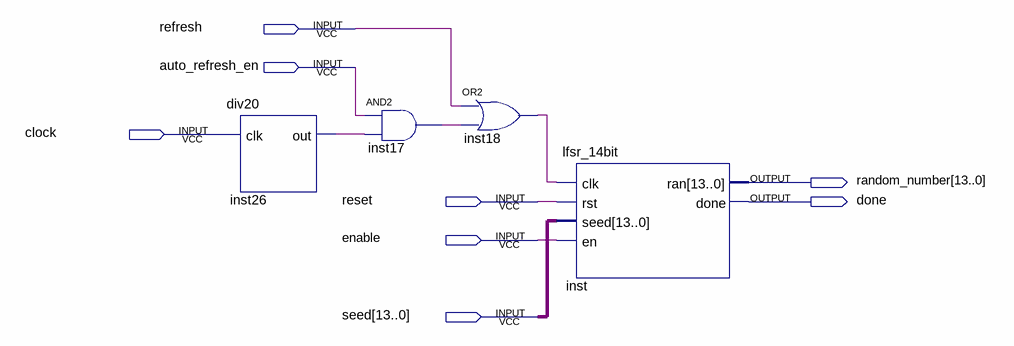
[diagram p0: schematic sheet]
// Quartus schematic random_gen.bdf as structural Verilog: 4 symbols, 8 pins
module random_gen (
  input  refresh,
  input  auto_refresh_en,
  input  clock,
  input  reset,
  input  enable,
  input  [13:0] seed,
  output [13:0] random_number,
  output done
);

  wire inst17_out, inst18_out, inst26_out;

  div20 inst26 (.clk(clock), .out(inst26_out));
  and inst17 (inst17_out, auto_refresh_en, inst26_out);
  or inst18 (inst18_out, refresh, inst17_out);
  lfsr_14bit inst (.clk(inst18_out), .rst(reset), .seed(seed), .en(enable), .ran(random_number), .done(done));
endmodule
